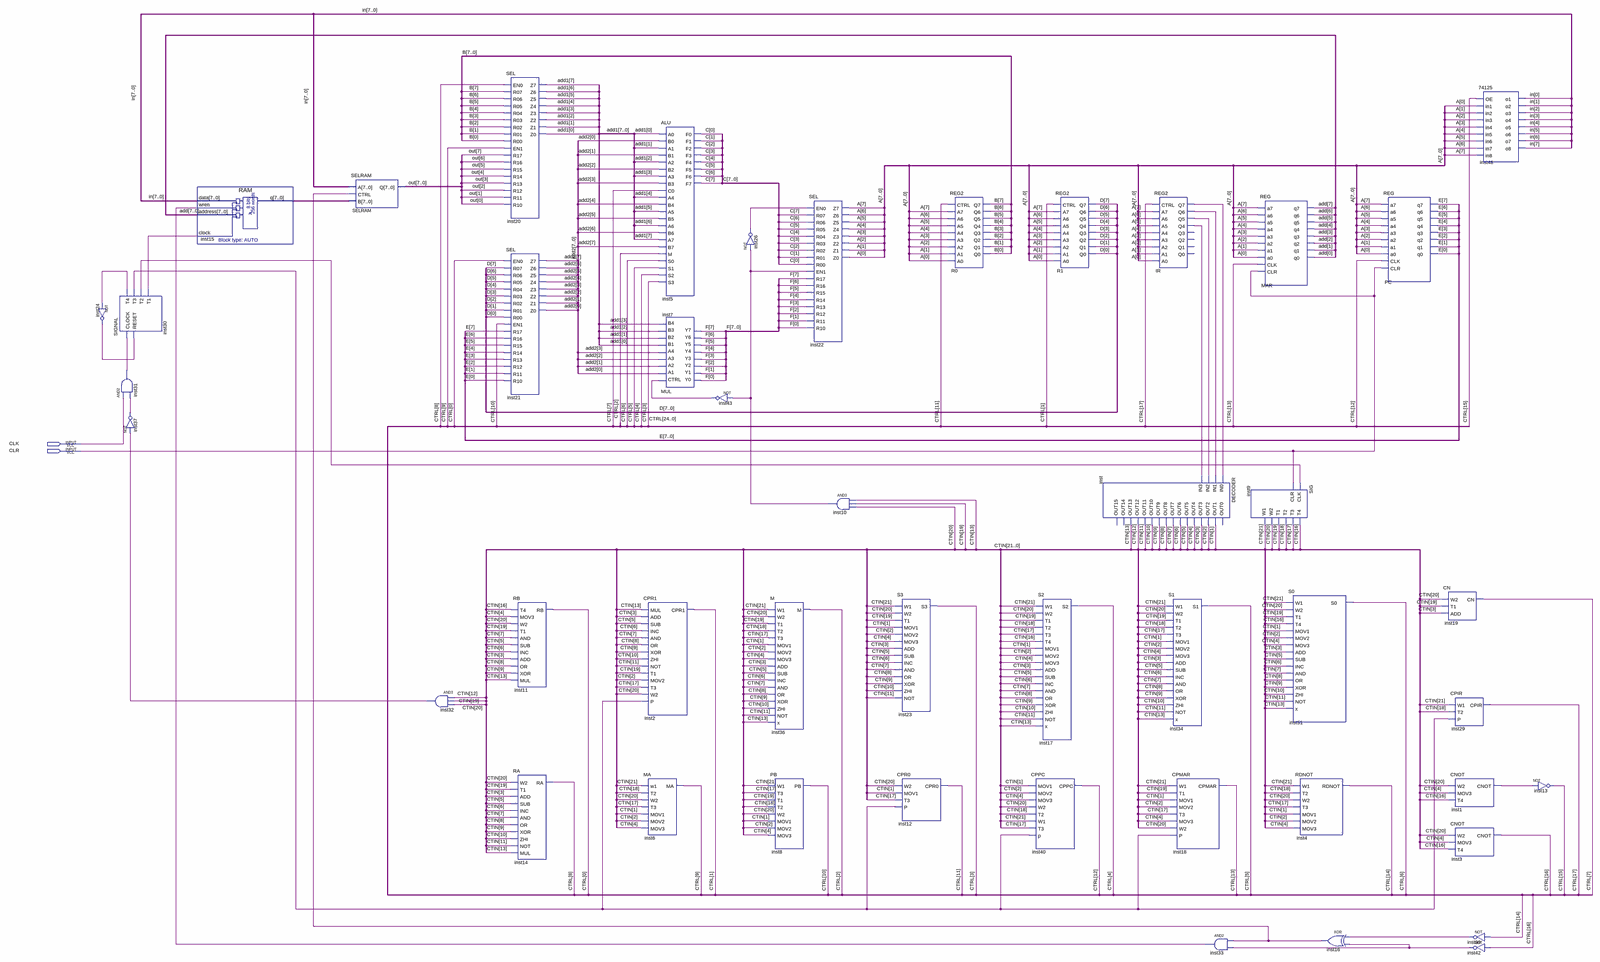
[diagram p0: schematic sheet, whole]
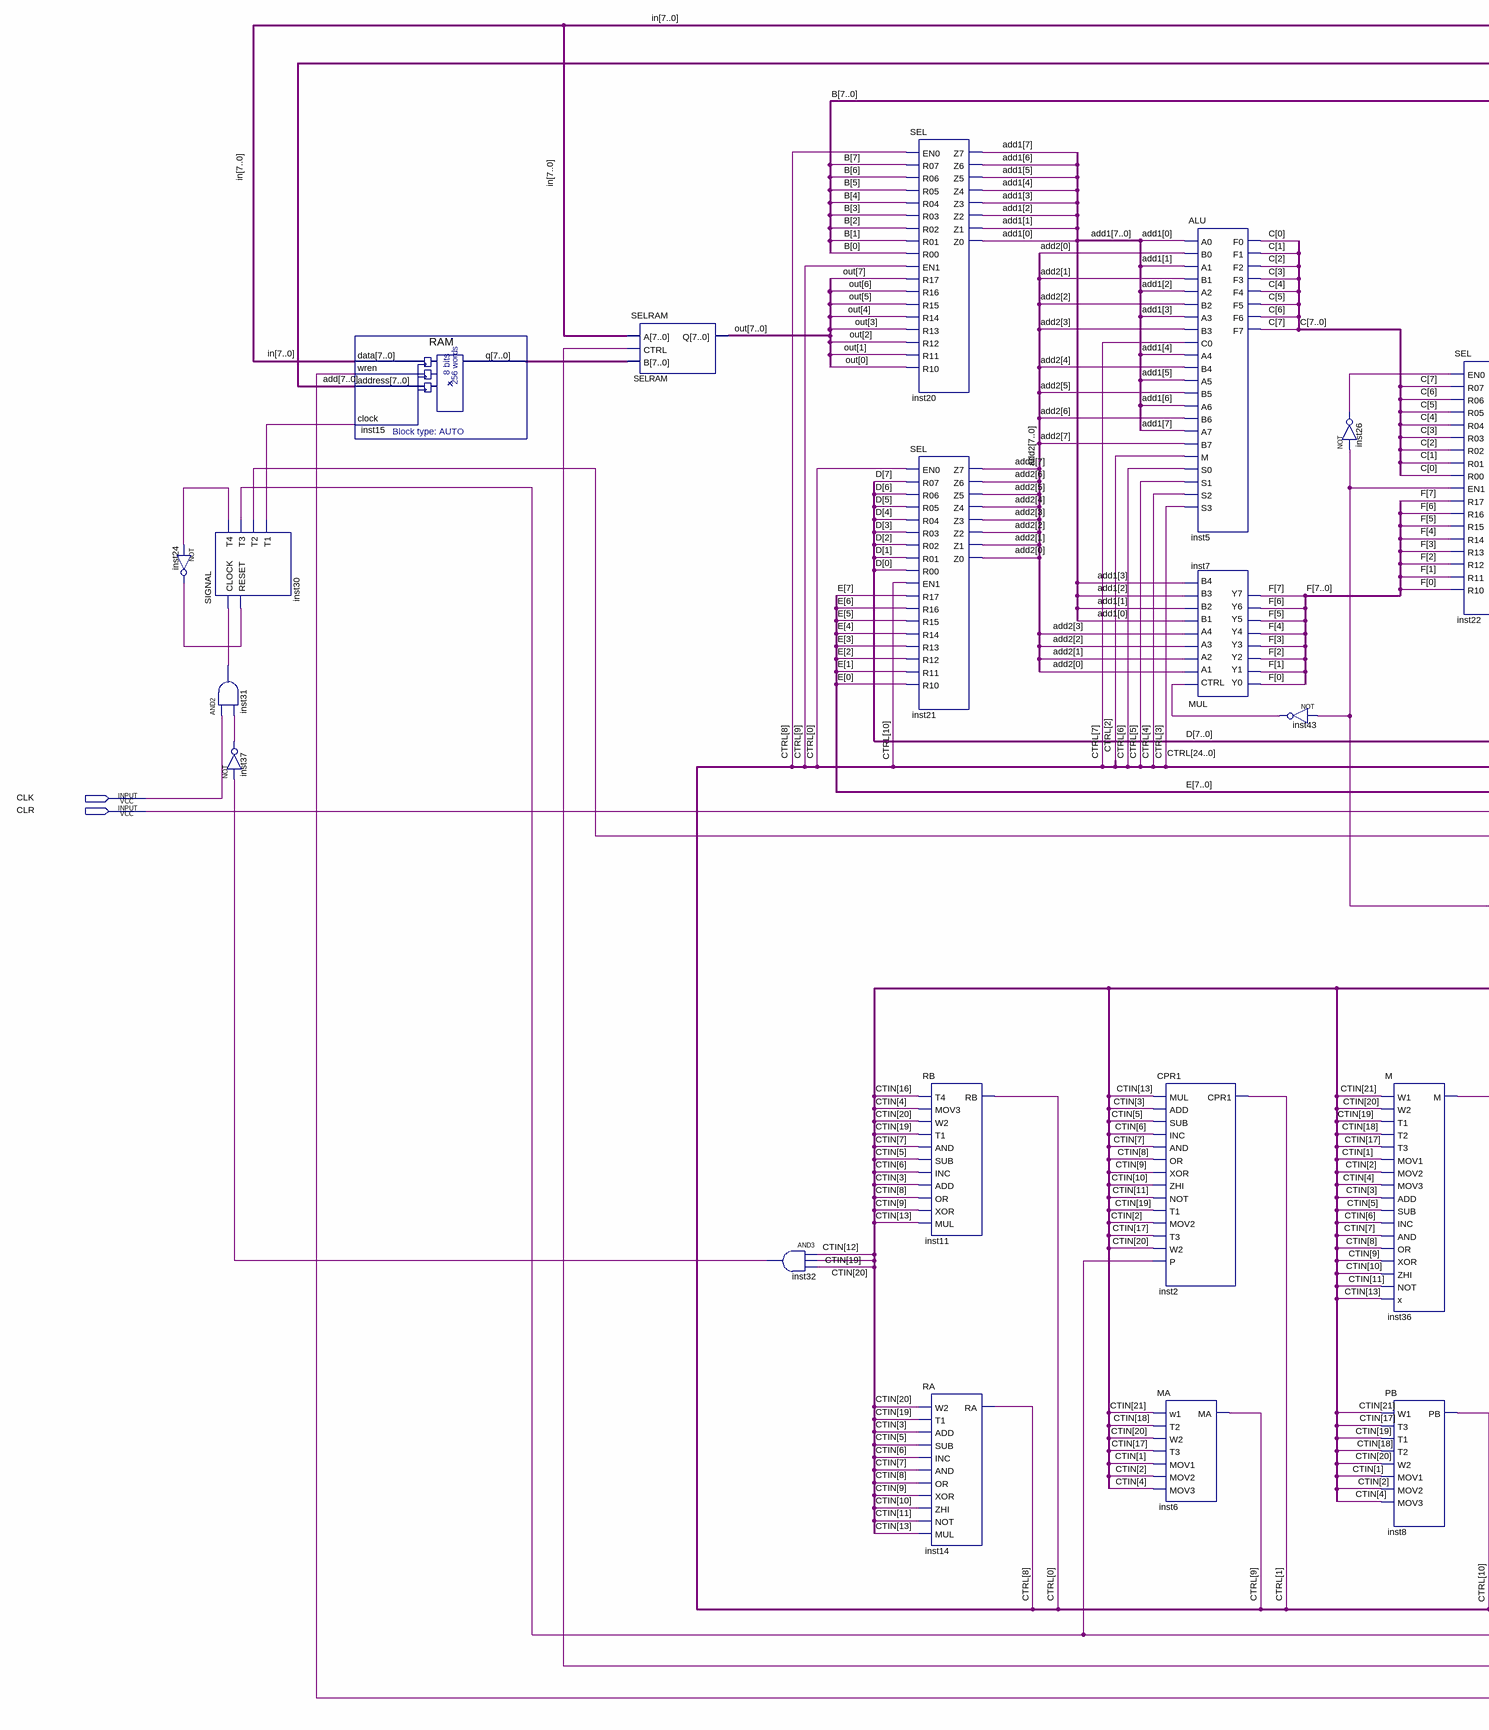
[diagram p1: schematic sheet, left part]
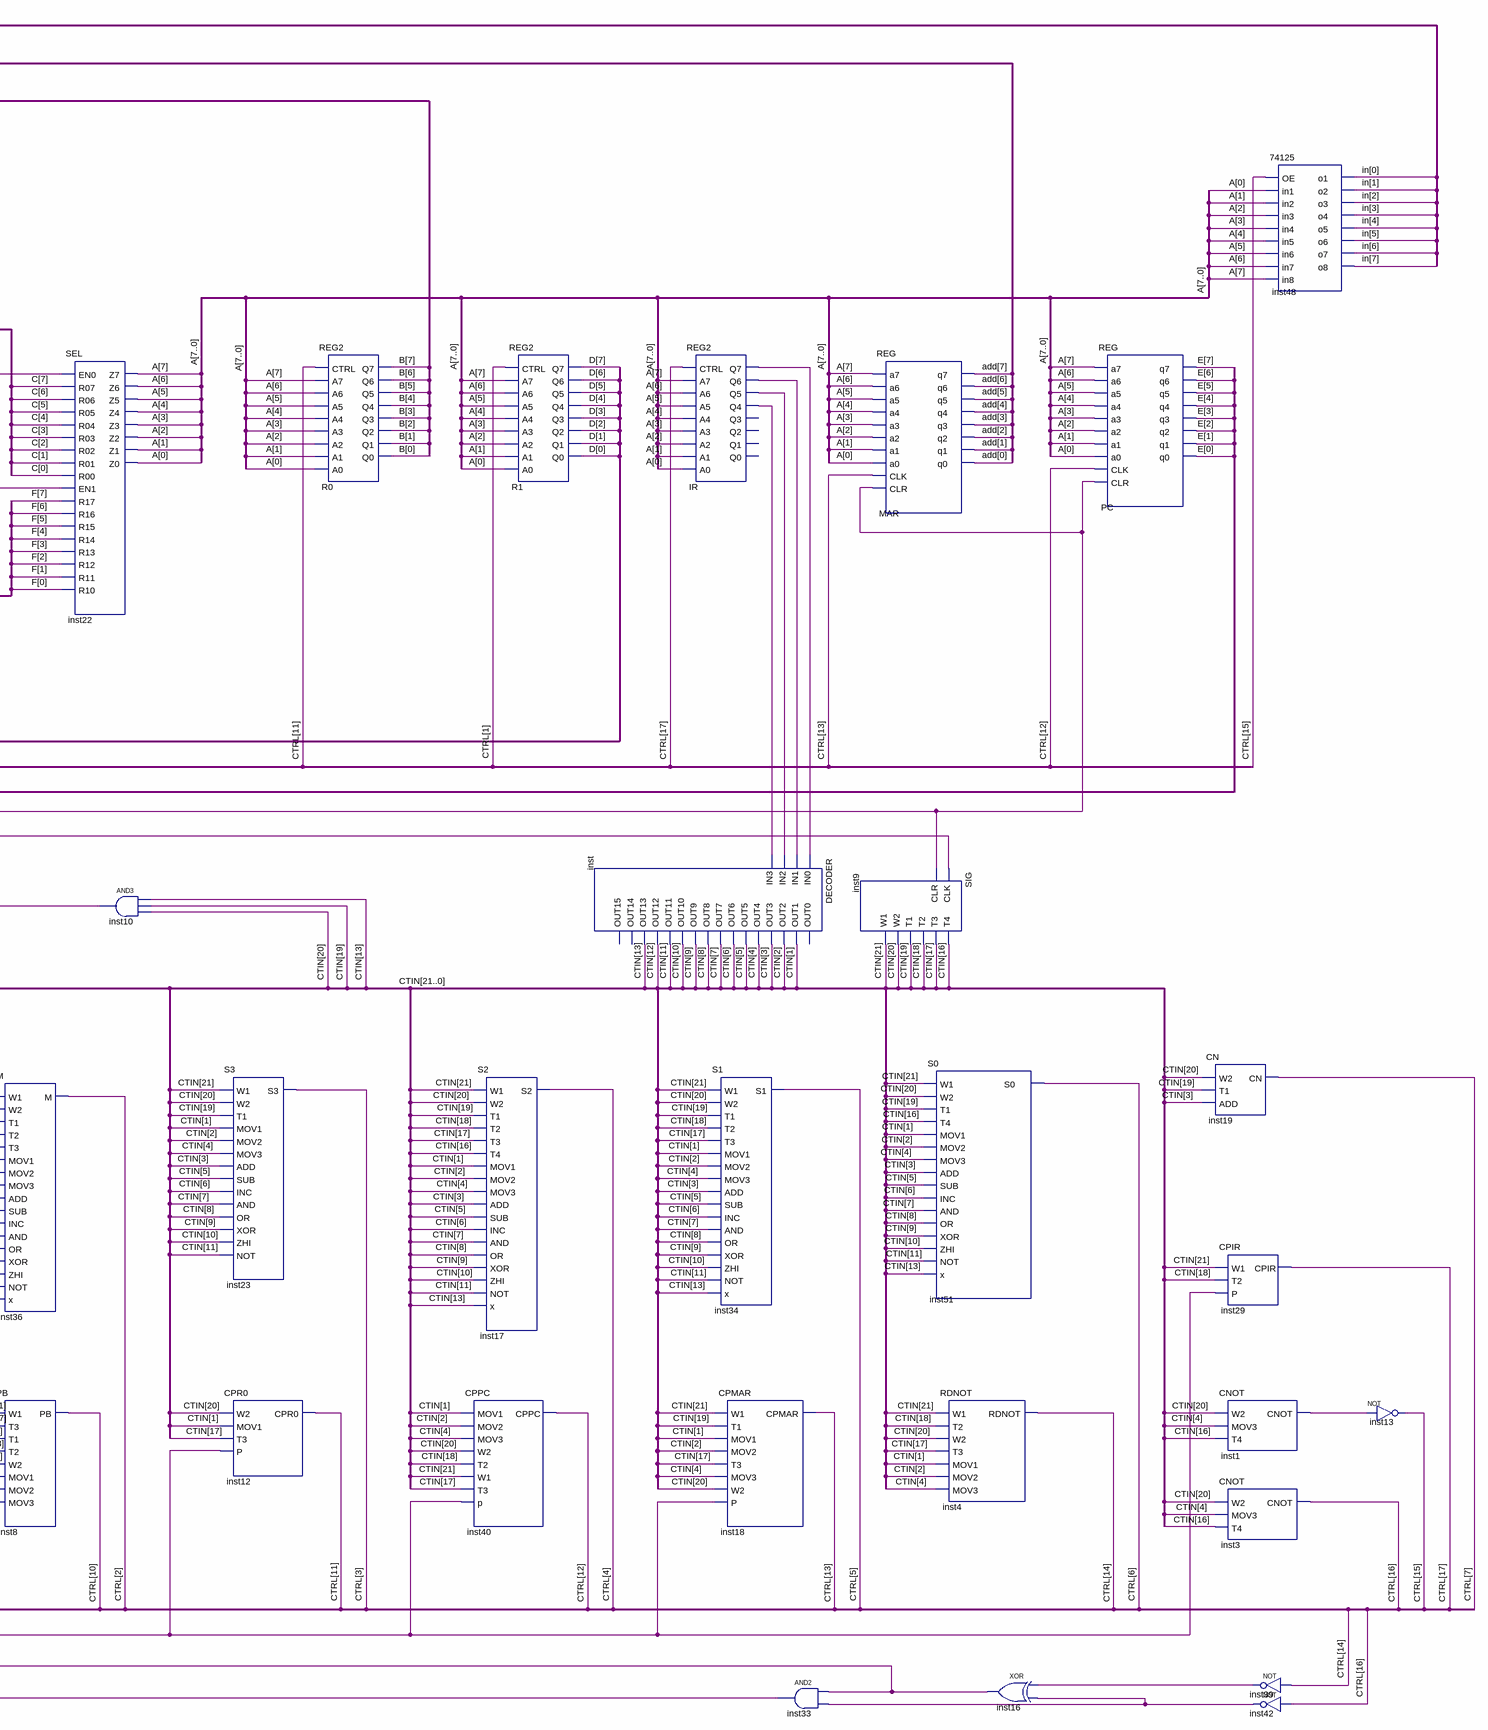
[diagram p2: schematic sheet, right part]
// Quartus schematic LAB4.bdf as structural Verilog: 46 symbols, 2 pins
module LAB4 (
  input  CLK,
  input  CLR
);

  wire inst1_cnot, inst10_out, inst16_out, inst24_out, inst26_out, inst30_t1, inst30_t2, inst30_t3,
       inst30_t4, inst31_out, inst32_out, inst33_out, inst37_out, inst39_out, inst42_out, inst43_out, IR_q4,
       IR_q5, IR_q6, IR_q7;
  wire [7:0] A, add, add1, add2, B, C, D, E, F, in, inst15_q, out;
  wire [17:0] CTRL;
  wire [21:1] CTIN;

  not inst24 (inst24_out, inst30_t4);
  SIGNAL inst30 (
    .CLOCK(inst31_out), .RESET(inst24_out), .T4(inst30_t4), .T3(inst30_t3), .T2(inst30_t2), .T1(inst30_t1));
  and inst31 (inst31_out, CLK, inst37_out);
  not inst37 (inst37_out, inst32_out);
  RAM inst15 (.data(in), .wren(inst33_out), .address(add), .clock(inst30_t1), .q(inst15_q));
  SELRAM SELRAM (.A(in), .CTRL(inst16_out), .B(inst15_q), .Q(out));
  and inst32 (inst32_out, CTIN[12], CTIN[19], CTIN[20]);
  SEL inst20 (
    .EN0(CTRL[8]), .R07(B[7]), .R06(B[6]), .R05(B[5]), .R04(B[4]), .R03(B[3]), .R02(B[2]), .R01(B[1]),
    .R00(B[0]), .EN1(CTRL[9]), .R17(out[7]), .R16(out[6]), .R15(out[5]), .R14(out[4]), .R13(out[3]),
    .R12(out[2]), .R11(out[1]), .R10(out[0]), .Z7(add1[7]), .Z6(add1[6]), .Z5(add1[5]), .Z4(add1[4]),
    .Z3(add1[3]), .Z2(add1[2]), .Z1(add1[1]), .Z0(add1[0]));
  SEL inst21 (
    .EN0(CTRL[0]), .R07(D[7]), .R06(D[6]), .R05(D[5]), .R04(D[4]), .R03(D[3]), .R02(D[2]), .R01(D[1]),
    .R00(D[0]), .EN1(CTRL[10]), .R17(E[7]), .R16(E[6]), .R15(E[5]), .R14(E[4]), .R13(E[3]), .R12(E[2]),
    .R11(E[1]), .R10(E[0]), .Z7(add2[7]), .Z6(add2[6]), .Z5(add2[5]), .Z4(add2[4]), .Z3(add2[3]),
    .Z2(add2[2]), .Z1(add2[1]), .Z0(add2[0]));
  RB inst11 (
    .T4(CTIN[16]), .MOV3(CTIN[4]), .W2(CTIN[20]), .T1(CTIN[19]), .AND(CTIN[7]), .SUB(CTIN[5]), .INC(CTIN[6]),
    .ADD(CTIN[3]), .OR(CTIN[8]), .XOR(CTIN[9]), .MUL(CTIN[13]), .RB(CTRL[0]));
  RA inst14 (
    .W2(CTIN[20]), .T1(CTIN[19]), .ADD(CTIN[3]), .SUB(CTIN[5]), .INC(CTIN[6]), .AND(CTIN[7]), .OR(CTIN[8]),
    .XOR(CTIN[9]), .ZHI(CTIN[10]), .NOT(CTIN[11]), .MUL(CTIN[13]), .RA(CTRL[8]));
  CPR1 inst2 (
    .MUL(CTIN[13]), .ADD(CTIN[3]), .SUB(CTIN[5]), .INC(CTIN[6]), .AND(CTIN[7]), .OR(CTIN[8]), .XOR(CTIN[9]),
    .ZHI(CTIN[10]), .NOT(CTIN[11]), .T1(CTIN[19]), .MOV2(CTIN[2]), .T3(CTIN[17]), .W2(CTIN[20]),
    .P(inst30_t3), .CPR1(CTRL[1]));
  MA inst6 (
    .w1(CTIN[21]), .T2(CTIN[18]), .W2(CTIN[20]), .T3(CTIN[17]), .MOV1(CTIN[1]), .MOV2(CTIN[2]),
    .MOV3(CTIN[4]), .MA(CTRL[9]));
  ALU inst5 (
    .A0(add1[0]), .B0(add2[0]), .A1(add1[1]), .B1(add2[1]), .A2(add1[2]), .B2(add2[2]), .A3(add1[3]),
    .B3(add2[3]), .C0(CTRL[7]), .A4(add1[4]), .B4(add2[4]), .A5(add1[5]), .B5(add2[5]), .A6(add1[6]),
    .B6(add2[6]), .A7(add1[7]), .B7(add2[7]), .M(CTRL[2]), .S0(CTRL[6]), .S1(CTRL[5]), .S2(CTRL[4]),
    .S3(CTRL[3]), .F0(C[0]), .F1(C[1]), .F2(C[2]), .F3(C[3]), .F4(C[4]), .F5(C[5]), .F6(C[6]), .F7(C[7]));
  MUL inst7 (
    .CTRL(inst43_out), .A1(add2[0]), .A2(add2[1]), .A3(add2[2]), .A4(add2[3]), .B1(add1[0]), .B2(add1[1]),
    .B3(add1[2]), .B4(add1[3]), .Y0(F[0]), .Y1(F[1]), .Y2(F[2]), .Y3(F[3]), .Y4(F[4]), .Y5(F[5]), .Y6(F[6]),
    .Y7(F[7]));
  not inst43 (inst43_out, inst10_out);
  not inst26 (inst26_out, inst10_out);
  M inst36 (
    .W1(CTIN[21]), .W2(CTIN[20]), .T1(CTIN[19]), .T2(CTIN[18]), .T3(CTIN[17]), .MOV1(CTIN[1]),
    .MOV2(CTIN[2]), .MOV3(CTIN[4]), .ADD(CTIN[3]), .SUB(CTIN[5]), .INC(CTIN[6]), .AND(CTIN[7]), .OR(CTIN[8]),
    .XOR(CTIN[9]), .ZHI(CTIN[10]), .NOT(CTIN[11]), .x(CTIN[13]), .M(CTRL[2]));
  PB inst8 (
    .W1(CTIN[21]), .T3(CTIN[17]), .T1(CTIN[19]), .T2(CTIN[18]), .W2(CTIN[20]), .MOV1(CTIN[1]),
    .MOV2(CTIN[2]), .MOV3(CTIN[4]), .PB(CTRL[10]));
  SEL inst22 (
    .EN0(inst26_out), .R07(C[7]), .R06(C[6]), .R05(C[5]), .R04(C[4]), .R03(C[3]), .R02(C[2]), .R01(C[1]),
    .R00(C[0]), .EN1(inst10_out), .R17(F[7]), .R16(F[6]), .R15(F[5]), .R14(F[4]), .R13(F[3]), .R12(F[2]),
    .R11(F[1]), .R10(F[0]), .Z7(A[7]), .Z6(A[6]), .Z5(A[5]), .Z4(A[4]), .Z3(A[3]), .Z2(A[2]), .Z1(A[1]),
    .Z0(A[0]));
  and inst10 (inst10_out, CTIN[13], CTIN[19], CTIN[20]);
  S3 inst23 (
    .W1(CTIN[21]), .W2(CTIN[20]), .T1(CTIN[19]), .MOV1(CTIN[1]), .MOV2(CTIN[2]), .MOV3(CTIN[4]),
    .ADD(CTIN[3]), .SUB(CTIN[5]), .INC(CTIN[6]), .AND(CTIN[7]), .OR(CTIN[8]), .XOR(CTIN[9]), .ZHI(CTIN[10]),
    .NOT(CTIN[11]), .S3(CTRL[3]));
  CPR0 inst12 (.W2(CTIN[20]), .MOV1(CTIN[1]), .T3(CTIN[17]), .P(inst30_t3), .CPR0(CTRL[11]));
  REG2 R0 (
    .CTRL(CTRL[11]), .A7(A[7]), .A6(A[6]), .A5(A[5]), .A4(A[4]), .A3(A[3]), .A2(A[2]), .A1(A[1]), .A0(A[0]),
    .Q7(B[7]), .Q6(B[6]), .Q5(B[5]), .Q4(B[4]), .Q3(B[3]), .Q2(B[2]), .Q1(B[1]), .Q0(B[0]));
  S2 inst17 (
    .W1(CTIN[21]), .W2(CTIN[20]), .T1(CTIN[19]), .T2(CTIN[18]), .T3(CTIN[17]), .T4(CTIN[16]), .MOV1(CTIN[1]),
    .MOV2(CTIN[2]), .MOV3(CTIN[4]), .ADD(CTIN[3]), .SUB(CTIN[5]), .INC(CTIN[6]), .AND(CTIN[7]), .OR(CTIN[8]),
    .XOR(CTIN[9]), .ZHI(CTIN[10]), .NOT(CTIN[11]), .x(CTIN[13]), .S2(CTRL[4]));
  CPPC inst40 (
    .MOV1(CTIN[1]), .MOV2(CTIN[2]), .MOV3(CTIN[4]), .W2(CTIN[20]), .T2(CTIN[18]), .W1(CTIN[21]),
    .T3(CTIN[17]), .p(inst30_t3), .CPPC(CTRL[12]));
  REG2 R1 (
    .CTRL(CTRL[1]), .A7(A[7]), .A6(A[6]), .A5(A[5]), .A4(A[4]), .A3(A[3]), .A2(A[2]), .A1(A[1]), .A0(A[0]),
    .Q7(D[7]), .Q6(D[6]), .Q5(D[5]), .Q4(D[4]), .Q3(D[3]), .Q2(D[2]), .Q1(D[1]), .Q0(D[0]));
  DECODER inst (
    .IN0(IR_q7), .IN1(IR_q6), .IN2(IR_q5), .IN3(IR_q4), .OUT1(CTIN[1]), .OUT2(CTIN[2]), .OUT3(CTIN[3]),
    .OUT4(CTIN[4]), .OUT5(CTIN[5]), .OUT6(CTIN[6]), .OUT7(CTIN[7]), .OUT8(CTIN[8]), .OUT9(CTIN[9]),
    .OUT10(CTIN[10]), .OUT11(CTIN[11]), .OUT12(CTIN[12]), .OUT13(CTIN[13]));  // open: OUT0, OUT14, OUT15
  REG2 IR (
    .CTRL(CTRL[17]), .A7(A[7]), .A6(A[6]), .A5(A[5]), .A4(A[4]), .A3(A[3]), .A2(A[2]), .A1(A[1]), .A0(A[0]),
    .Q7(IR_q7), .Q6(IR_q6), .Q5(IR_q5), .Q4(IR_q4));  // open: Q3, Q2, Q1, Q0
  S1 inst34 (
    .W1(CTIN[21]), .W2(CTIN[20]), .T1(CTIN[19]), .T2(CTIN[18]), .T3(CTIN[17]), .MOV1(CTIN[1]),
    .MOV2(CTIN[2]), .MOV3(CTIN[4]), .ADD(CTIN[3]), .SUB(CTIN[5]), .INC(CTIN[6]), .AND(CTIN[7]), .OR(CTIN[8]),
    .XOR(CTIN[9]), .ZHI(CTIN[10]), .NOT(CTIN[11]), .x(CTIN[13]), .S1(CTRL[5]));
  CPMAR inst18 (
    .W1(CTIN[21]), .T1(CTIN[19]), .MOV1(CTIN[1]), .MOV2(CTIN[2]), .T3(CTIN[17]), .MOV3(CTIN[4]),
    .W2(CTIN[20]), .P(inst30_t3), .CPMAR(CTRL[13]));
  and inst33 (inst33_out, inst16_out, inst42_out);
  REG MAR (
    .a7(A[7]), .a6(A[6]), .a5(A[5]), .a4(A[4]), .a3(A[3]), .a2(A[2]), .a1(A[1]), .a0(A[0]), .CLK(CTRL[13]),
    .CLR(CLR), .q7(add[7]), .q6(add[6]), .q5(add[5]), .q4(add[4]), .q3(add[3]), .q2(add[2]), .q1(add[1]),
    .q0(add[0]));
  SIG inst9 (
    .CLK(inst30_t2), .CLR(CLR), .T4(CTIN[16]), .T3(CTIN[17]), .T2(CTIN[18]), .T1(CTIN[19]), .W2(CTIN[20]),
    .W1(CTIN[21]));
  S0 inst51 (
    .W1(CTIN[21]), .W2(CTIN[20]), .T1(CTIN[19]), .T4(CTIN[16]), .MOV1(CTIN[1]), .MOV2(CTIN[2]),
    .MOV3(CTIN[4]), .ADD(CTIN[3]), .SUB(CTIN[5]), .INC(CTIN[6]), .AND(CTIN[7]), .OR(CTIN[8]), .XOR(CTIN[9]),
    .ZHI(CTIN[10]), .NOT(CTIN[11]), .x(CTIN[13]), .S0(CTRL[6]));
  RDNOT inst4 (
    .W1(CTIN[21]), .T2(CTIN[18]), .W2(CTIN[20]), .T3(CTIN[17]), .MOV1(CTIN[1]), .MOV2(CTIN[2]),
    .MOV3(CTIN[4]), .RDNOT(CTRL[14]));
  xor inst16 (inst16_out, inst39_out, inst42_out);
  REG PC (
    .a7(A[7]), .a6(A[6]), .a5(A[5]), .a4(A[4]), .a3(A[3]), .a2(A[2]), .a1(A[1]), .a0(A[0]), .CLK(CTRL[12]),
    .CLR(CLR), .q7(E[7]), .q6(E[6]), .q5(E[5]), .q4(E[4]), .q3(E[3]), .q2(E[2]), .q1(E[1]), .q0(E[0]));
  CN inst19 (.W2(CTIN[20]), .T1(CTIN[19]), .ADD(CTIN[3]), .CN(CTRL[7]));
  CPIR inst29 (.W1(CTIN[21]), .T2(CTIN[18]), .P(inst30_t3), .CPIR(CTRL[17]));
  CNOT inst1 (.W2(CTIN[20]), .MOV3(CTIN[4]), .T4(CTIN[16]), .CNOT(inst1_cnot));
  CNOT inst3 (.W2(CTIN[20]), .MOV3(CTIN[4]), .T4(CTIN[16]), .CNOT(CTRL[16]));
  \74125  inst48 (
    .OE(CTRL[15]), .in1(A[0]), .in2(A[1]), .in3(A[2]), .in4(A[3]), .in5(A[4]), .in6(A[5]), .in7(A[6]),
    .in8(A[7]), .o1(in[0]), .o2(in[1]), .o3(in[2]), .o4(in[3]), .o5(in[4]), .o6(in[5]), .o7(in[6]), .o8(in[7]));
  not inst39 (inst39_out, CTRL[14]);
  not inst42 (inst42_out, CTRL[16]);
  not inst13 (CTRL[15], inst1_cnot);
endmodule
